# EAGLE design BLDC_Controller (EAGLE 7.5.0)
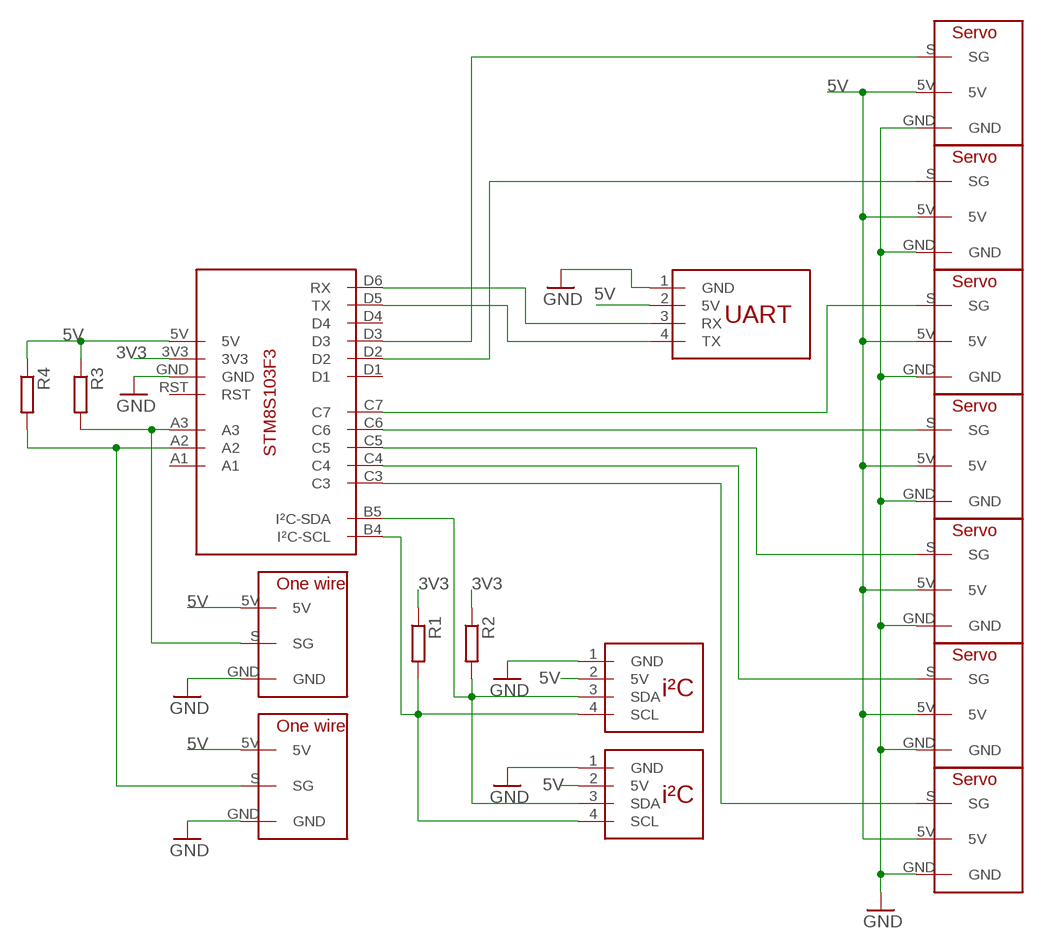
[diagram p0: schematic, sheet 1]

## Parts
R1  1k  R-EU_R1206  [R1206]
R2  1k  R-EU_R1206  [R1206]
R3  1k  R-EU_R1206  [R1206]
R4  1k  R-EU_R1206  [R1206]
U$1  STM8S103F3-DEVKITMINI  [STM8S103F3-DEVKIT-MINI]
U$2  SERVO  [SERVO]
U$3  UARTMINI  [UART-MINI]
U$4  I2CMINI  [I2C-MINI]
U$5  ONE_WIRE  [ONE_WIRE]
U$6  ONE_WIRE  [ONE_WIRE]
U$7  I2CMINI  [I2C-MINI]
U$8  SERVO  [SERVO]
U$9  SERVO  [SERVO]
U$10  SERVO  [SERVO]
U$11  SERVO  [SERVO]
U$12  SERVO  [SERVO]
U$13  SERVO  [SERVO]

## Nets
3V3: R1.1 R2.1 U$1.3V3
5V: R3.1 R4.1 U$1.5V U$2.5V U$3.2(5V) U$4.2(5V) U$5.5V U$6.5V U$7.2(5V) U$8.5V U$9.5V U$10.5V U$11.5V U$12.5V U$13.5V
GND: U$1.GND U$2.GND U$3.1(GND) U$4.1(GND) U$5.GND U$6.GND U$7.1(GND) U$8.GND U$9.GND U$10.GND U$11.GND U$12.GND U$13.GND
N$1: U$1.D5(TX) U$3.4(TX)
N$2: U$1.C3 U$13.S(SG)
N$3: U$1.C4 U$12.S(SG)
N$4: U$1.C5 U$10.S(SG)
N$5: U$1.C6 U$9.S(SG)
N$6: U$1.C7 U$8.S(SG)
N$7: R2.2 U$1.B5(I²C-SDA) U$4.3(SDA) U$7.3(SDA)
N$8: U$1.D2 U$2.S(SG)
N$9: U$1.D6(RX) U$3.3(RX)
N$10: R3.2 U$1.A3 U$6.S(SG)
N$11: U$1.D3 U$11.S(SG)
N$12: R4.2 U$1.A2 U$5.S(SG)
N$13: R1.2 U$1.B4(I²C-SCL) U$4.4(SCL) U$7.4(SCL)
Unconnected: U$1.A1 U$1.D1 U$1.D4 U$1.RST

## Library data of the parts
R1-R4 = resistor:R-EU_: RESISTOR, European symbol
U$1 = STM8DevKit:STM8S103F3-DEVKIT: Development kit of the STM8S103F3 with a Test Led, power Led and reset button
U$2 U$8-U$13 = Servo:SERVO
U$3 = WFConnectors:UART
U$4 U$7 = WFConnectors:I2C
U$5 U$6 = one-wire:ONE_WIRE

## Net classes
0 default: width 0.305 mm, drill 0.508 mm, clearance 0.254 mm

## Board
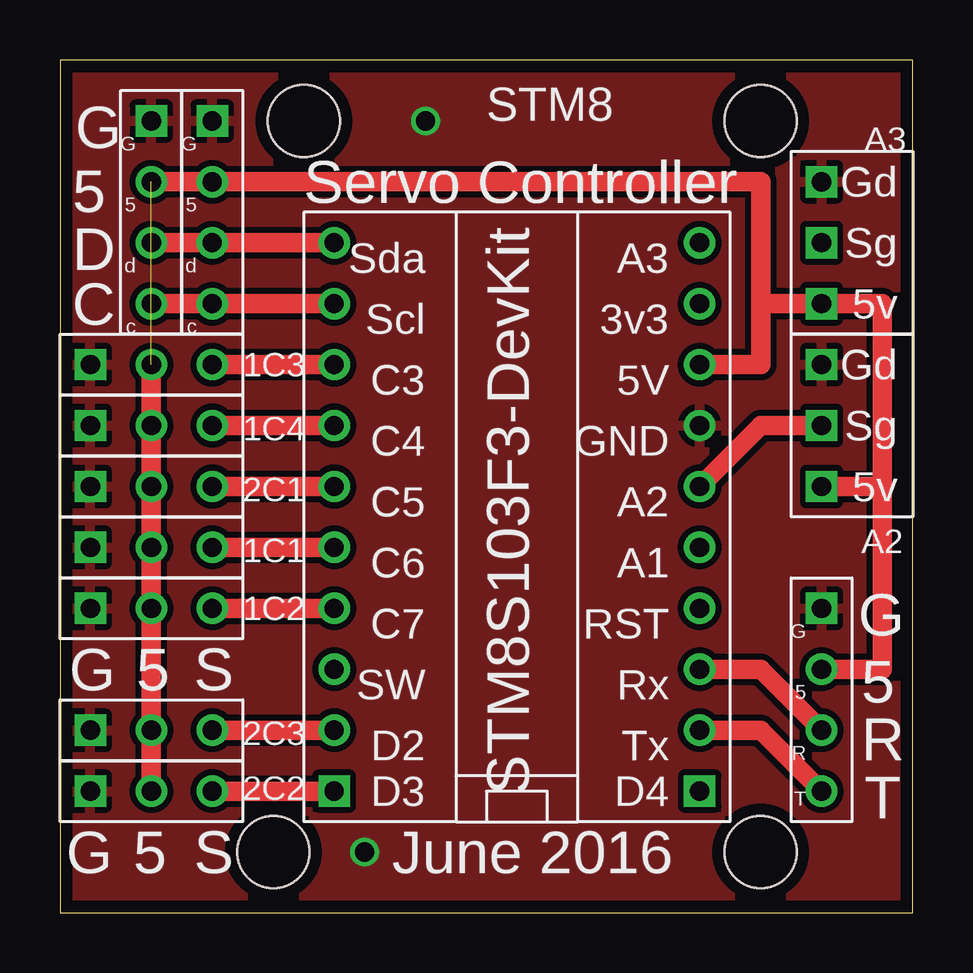
[diagram p1: board, top side]
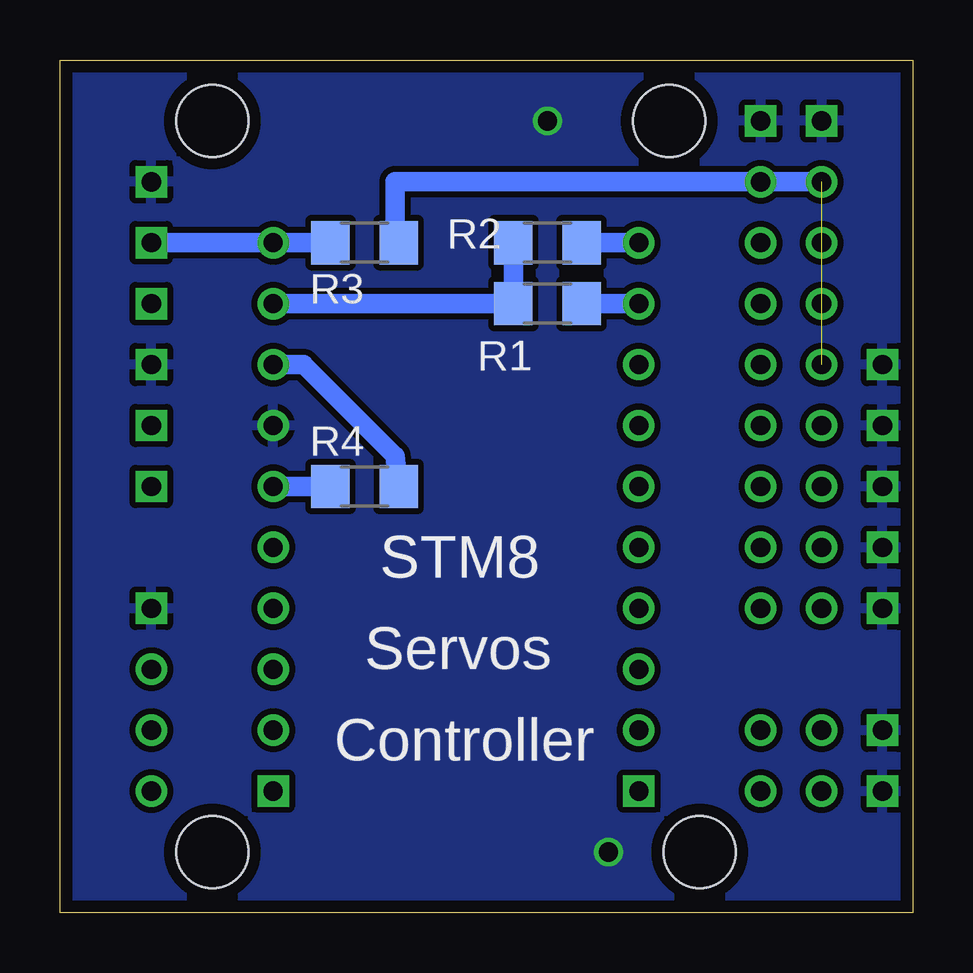
[diagram p2: board, bottom side, seen from below]

Size 35.56 x 35.56 mm. Coordinates in mm from the lower left corner, seen from the top.
Outline: 0,0 35.56,0 35.56,35.56 0,35.55 0,0
Copper layers (1*16): Top 0.035mm / dielectric 1.5mm / Bottom 0.035mm
Design rules "SmartPrototypingEagleRules": minimum track width 7mil, minimum drill 12mil, track to track 7mil, track to pad 7mil, pad to pad 7mil, via to via 7mil, smd to smd 0mil, copper to edge 20mil, drill to drill 10mil, minimum pad ring 10mil, minimum via ring 6mil, stop-mask expansion 2mil, vias tented up to drill 25mil, thermal gap 10mil
Holes 3 mm at 8.89,2.54 29.21,2.54 29.21,33.02 10.16,33.02

### Footprints (pad centres in the part's own frame; a part is rotated, then mirrored left to right if it is on the bottom)
R1206 = smd 1.6 x 1.803: 1 -1.422,0; 2 1.422,0
STM8S103F3-DEVKIT-MINI = drill 0.8: 3V3 -7.62,-7.62; 5V -7.62,-5.08; A1 -7.62,2.54; A2 -7.62,0; A3 -7.62,-10.16; B4 7.62,-7.62; B5 7.62,-10.16; C3 7.62,-5.08; C4 7.62,-2.54; C5 7.62,0; C6 7.62,2.54; C7 7.62,5.08; D1 7.62,7.62; D2 7.62,10.16; D5 -7.62,10.16; D6 -7.62,7.62; GND -7.62,-2.54; RST -7.62,5.08 | drill 0.8 square: D3 7.62,12.7; D4 -7.62,12.7
SERVO = drill 0.8: 5V 0,0; S 0,2.54 | drill 0.8 square: GND 0,-2.54
UART-MINI = drill 0.8 square: 1 0,0 | drill 0.8: 2 0,2.54; 3 0,5.08; 4 0,7.62
I2C-MINI = drill 0.8 square: 1 0,0 | drill 0.8: 2 0,2.54; 3 0,5.08; 4 0,7.62
ONE_WIRE = drill 0.8 square: 5V 0,2.54; GND 0,-2.54; S 0,0

### Placement (x,y rotation side)
R1  15.24,25.4 0 bottom
R2  15.24,27.94 0 bottom
R3  22.86,27.94 180 bottom
R4  22.86,17.78 180 bottom
U$1  19.05,17.78 180 top
U$2  3.81,7.62 270 top
U$3  31.75,12.7 180 top
U$4  6.35,33.02 180 top
U$5  31.75,20.32 180 top
U$6  31.75,27.94 180 top
U$7  3.81,33.02 180 top
U$8  3.81,12.7 270 top
U$9  3.81,15.24 270 top
U$10  3.81,17.78 270 top
U$11  3.81,5.08 270 top
U$12  3.81,20.32 270 top
U$13  3.81,22.86 270 top

### Tracks (layer width: path | path; a pad name or v marks a point on that pad's centre or on a via)
3V3
  Bottom 0.813: R2.1 R1.1 U$1.3V3
5V  (1 unrouted)
  Top 0.813: U$11.5V U$2.5V U$8.5V U$9.5V U$10.5V U$12.5V U$13.5V | 34.29,17.78 34.29,10.16 U$3.2 | 34.29,17.78 U$5.5V | 34.29,17.78 34.29,25.4 U$6.5V 29.21,25.4 | 29.21,25.4 29.21,30.48 U$4.2 U$7.2 | U$1.5V 29.21,22.86 29.21,25.4
  Bottom 0.813: R4.1 21.59,19.05 25.4,22.86 U$1.5V | U$7.2 21.59,30.48 21.59,28.09 R3.1
GND  (via drill 0.8)
  other vias: 15.24,33.02 12.7,2.54
  pour Bottom: 0,35.56 35.56,35.56 35.56,0 0,0
  pour Top: 0,35.56 35.56,35.56 35.56,0 0,0
N$1
  Top 0.813: U$1.D5 29.21,7.62 U$3.4
N$2
  Top 0.813: U$1.C3 U$13.S
N$3
  Top 0.813: U$12.S U$1.C4
N$4
  Top 0.813: U$1.C5 U$10.S
N$5
  Top 0.813: U$9.S U$1.C6
N$6
  Top 0.813: U$1.C7 U$8.S
N$7
  Top 0.813: U$1.B5 U$4.3 U$7.3
  Bottom 0.813: R2.2 U$1.B5
N$8
  Top 0.813: U$2.S U$1.D2
N$9
  Top 0.813: U$1.D6 29.21,10.16 U$3.3
N$10
  Bottom 0.813: R3.2 U$1.A3 U$6.S
N$11
  Top 0.813: U$1.D3 U$11.S
N$12
  Top 0.813: U$1.A2 29.21,20.32 U$5.S
  Bottom 0.813: 24.13,17.78 R4.2 U$1.A2
N$13
  Top 0.813: U$1.B4 U$4.4 U$7.4
  Bottom 0.813: R1.2 U$1.B4

### Text on the board
tPlace: STM8 | G | A3 | Servo Controller | 5 | D | C | 1C3 | 1C4 | 2C1 | 1C1 | A2 | 1C2 | G | G | 5 | S | 5 | 2C3 | R | 2C2 | T | G | 5 | S | June 2016
bPlace: STM8 | Servos | Controller